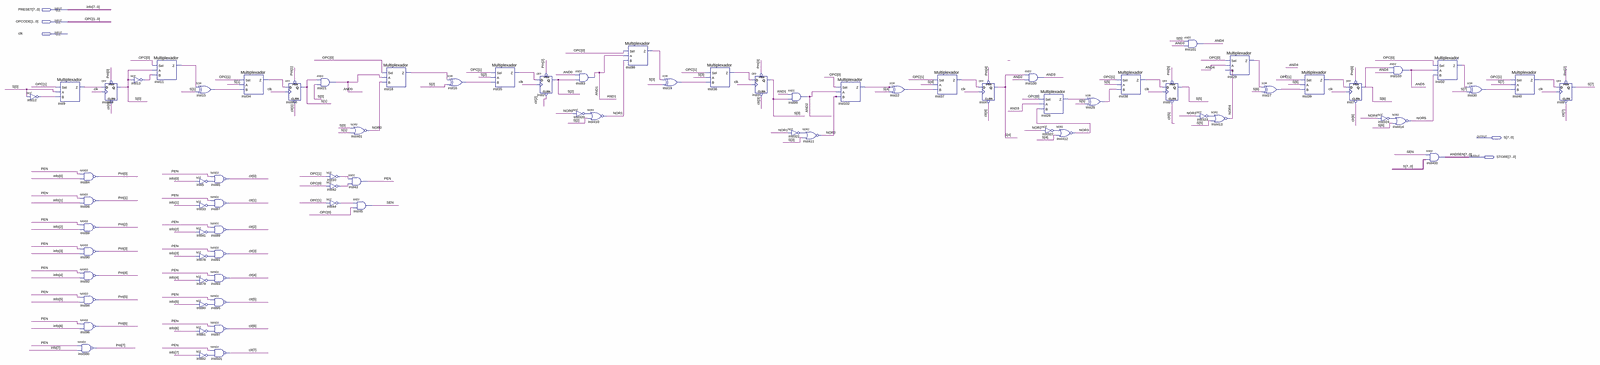
[diagram p0: schematic sheet, whole]
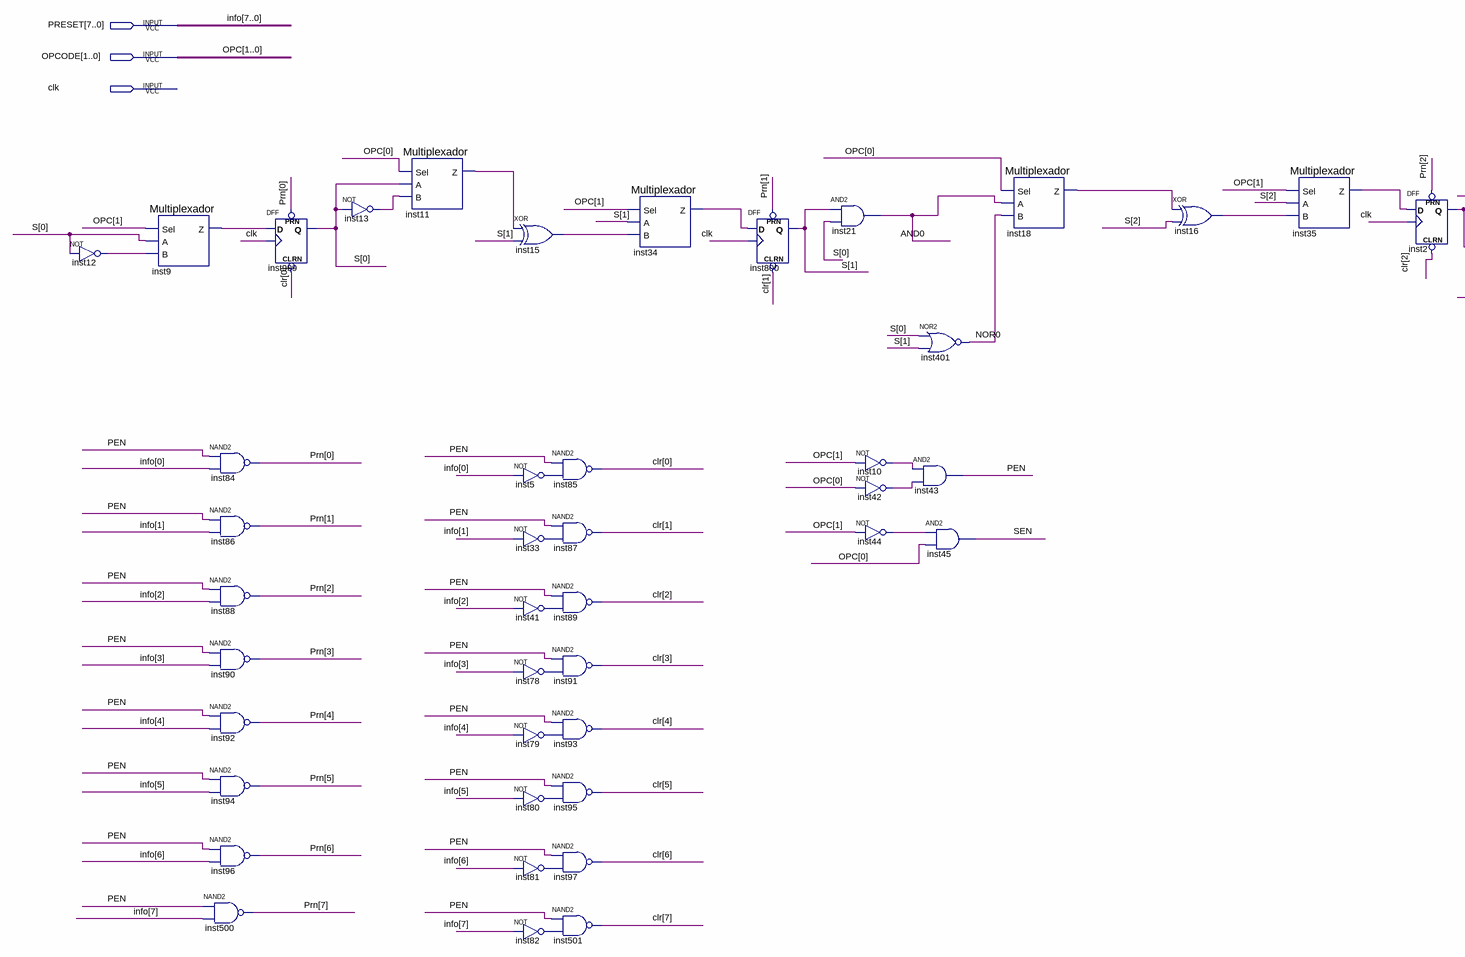
[diagram p1: schematic sheet, left part]
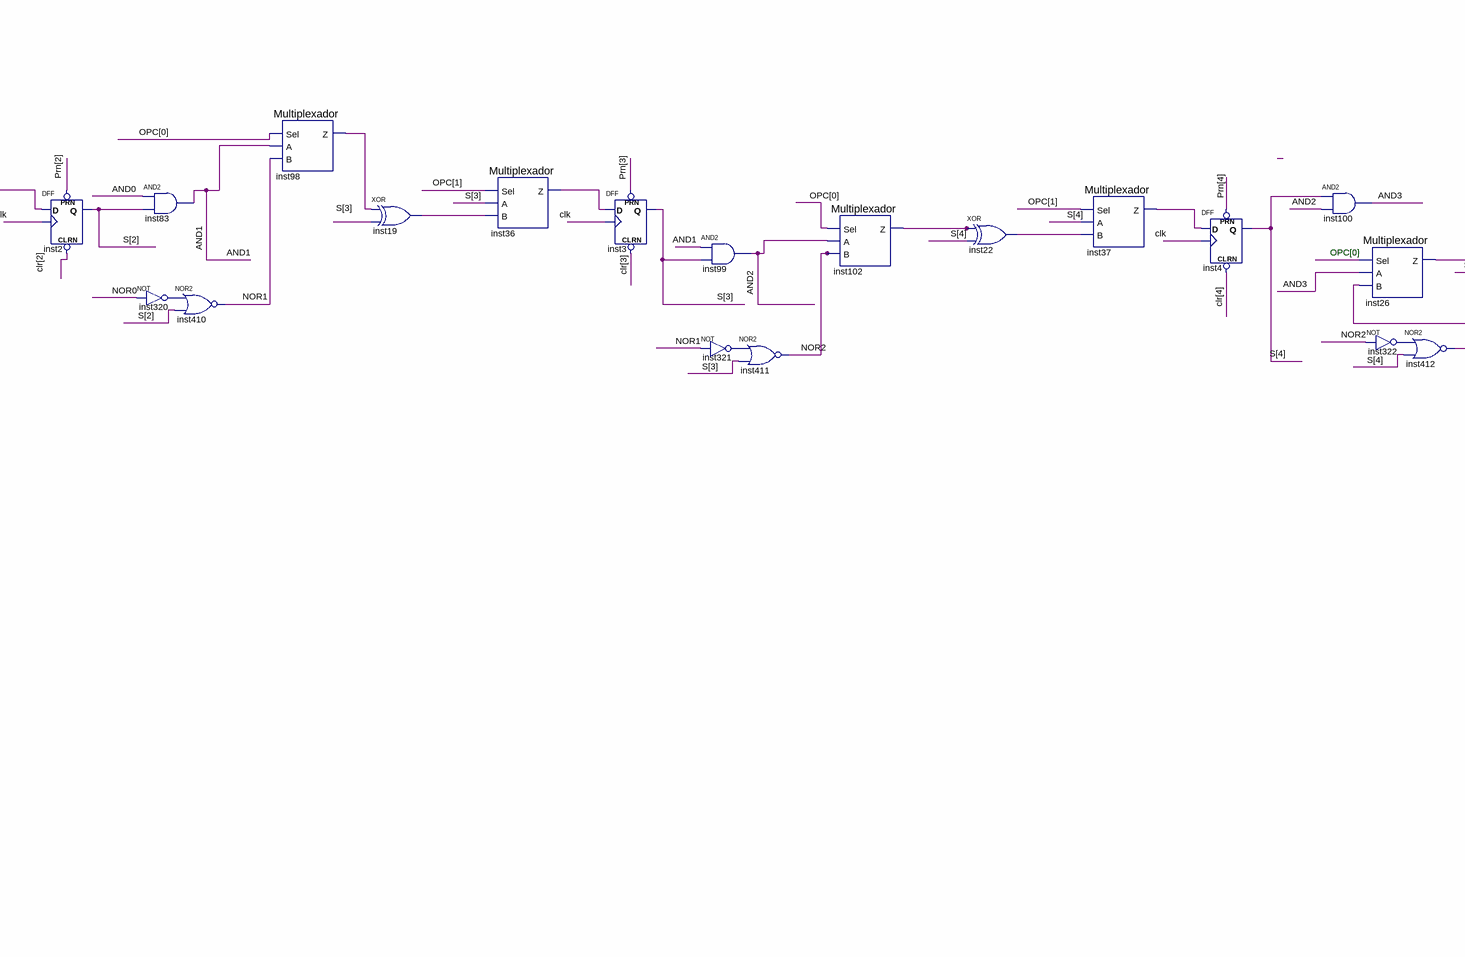
[diagram p2: schematic sheet, centre part]
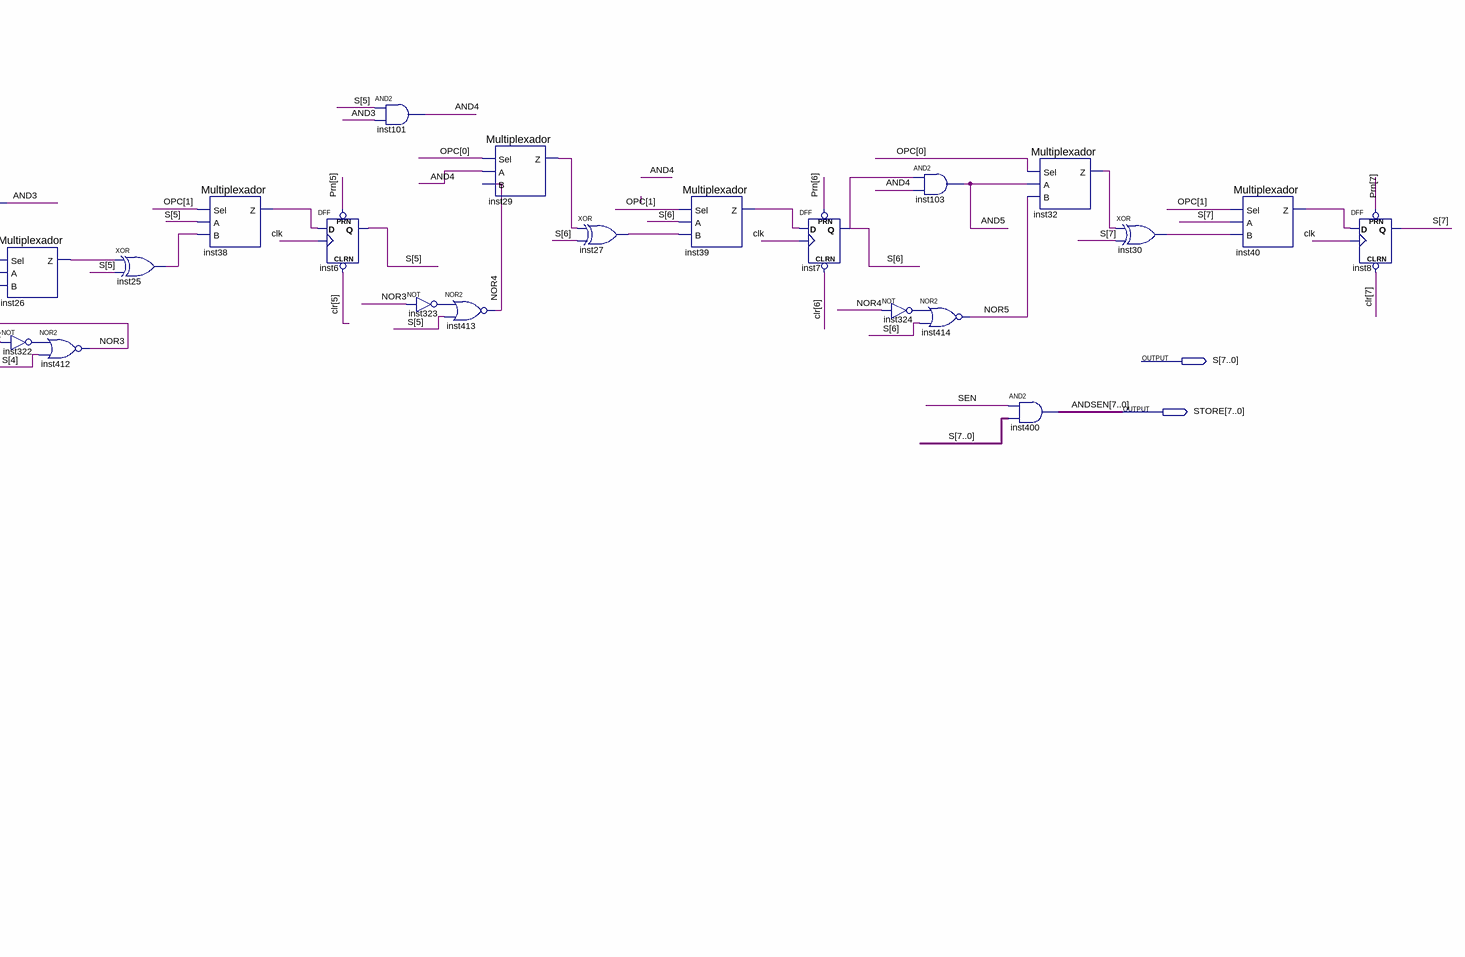
[diagram p3: schematic sheet, right part]
// Quartus schematic PC.bdf as structural Verilog: 79 symbols, 5 pins
module PC (
  input  [7:0] PRESET,
  input  [1:0] OPCODE,
  input  clk,
  output [7:0] S,
  output [7:0] STORE
);

  wire AND0, AND1, AND2, AND3, AND4, AND5, inst5_out, inst9_z, inst10_out, inst11_z, inst12_out, inst13_out,
       inst15_out, inst16_out, inst18_z, inst19_out, inst22_out, inst25_out, inst26_z, inst27_out, inst29_z,
       inst30_out, inst32_z, inst33_out, inst34_z, inst35_z, inst36_z, inst37_z, inst38_z, inst39_z,
       inst40_z, inst41_out, inst42_out, inst44_out, inst78_out, inst79_out, inst80_out, inst81_out,
       inst82_out, inst98_z, inst102_z, inst320_out, inst321_out, inst322_out, inst323_out, inst324_out,
       NOR0, NOR1, NOR2, NOR3, NOR4, NOR5, PEN, SEN;
  wire [7:0] clr, Prn;

  not inst12 (inst12_out, S[0]);
  Multiplexador inst9 (.Sel(OPCODE[1]), .A(S[0]), .B(inst12_out), .Z(inst9_z));
  nand inst84 (Prn[0], PEN, PRESET[0]);
  nand inst86 (Prn[1], PEN, PRESET[1]);
  nand inst88 (Prn[2], PEN, PRESET[2]);
  nand inst90 (Prn[3], PEN, PRESET[3]);
  nand inst92 (Prn[4], PEN, PRESET[4]);
  nand inst94 (Prn[5], PEN, PRESET[5]);
  nand inst96 (Prn[6], PEN, PRESET[6]);
  nand inst500 (Prn[7], PEN, PRESET[7]);
  DFF inst999 (.CLRN(clr[0]), .CLK(clk), .D(inst9_z), .PRN(Prn[0]), .Q(S[0]));
  not inst13 (inst13_out, S[0]);
  Multiplexador inst11 (.Sel(OPCODE[0]), .A(S[0]), .B(inst13_out), .Z(inst11_z));
  xor inst15 (inst15_out, inst11_z, S[1]);
  not inst5 (inst5_out, PRESET[0]);
  not inst33 (inst33_out, PRESET[1]);
  not inst41 (inst41_out, PRESET[2]);
  not inst78 (inst78_out, PRESET[3]);
  not inst79 (inst79_out, PRESET[4]);
  not inst80 (inst80_out, PRESET[5]);
  not inst81 (inst81_out, PRESET[6]);
  not inst82 (inst82_out, PRESET[7]);
  nand inst85 (clr[0], PEN, inst5_out);
  nand inst87 (clr[1], PEN, inst33_out);
  nand inst89 (clr[2], PEN, inst41_out);
  nand inst91 (clr[3], PEN, inst78_out);
  nand inst93 (clr[4], PEN, inst79_out);
  nand inst95 (clr[5], PEN, inst80_out);
  nand inst97 (clr[6], PEN, inst81_out);
  nand inst501 (clr[7], PEN, inst82_out);
  Multiplexador inst34 (.Sel(OPCODE[1]), .A(S[1]), .B(inst15_out), .Z(inst34_z));
  DFF inst800 (.CLRN(clr[1]), .CLK(clk), .D(inst34_z), .PRN(Prn[1]), .Q(S[1]));
  and inst21 (AND0, S[1], S[0]);
  not inst10 (inst10_out, OPCODE[1]);
  not inst42 (inst42_out, OPCODE[0]);
  not inst44 (inst44_out, OPCODE[1]);
  nor inst401 (NOR0, S[0], S[1]);
  and inst43 (PEN, inst10_out, inst42_out);
  and inst45 (SEN, inst44_out, OPCODE[0]);
  Multiplexador inst18 (.Sel(OPCODE[0]), .A(AND0), .B(NOR0), .Z(inst18_z));
  xor inst16 (inst16_out, inst18_z, S[2]);
  Multiplexador inst35 (.Sel(OPCODE[1]), .A(S[2]), .B(inst16_out), .Z(inst35_z));
  DFF inst2 (.CLRN(clr[2]), .CLK(clk), .D(inst35_z), .PRN(Prn[2]), .Q(S[2]));
  and inst83 (AND1, AND0, S[2]);
  not inst320 (inst320_out, NOR0);
  nor inst410 (NOR1, inst320_out, S[2]);
  Multiplexador inst98 (.Sel(OPCODE[0]), .A(AND1), .B(NOR1), .Z(inst98_z));
  xor inst19 (inst19_out, inst98_z, S[3]);
  Multiplexador inst36 (.Sel(OPCODE[1]), .A(S[3]), .B(inst19_out), .Z(inst36_z));
  DFF inst3 (.CLRN(clr[3]), .CLK(clk), .D(inst36_z), .PRN(Prn[3]), .Q(S[3]));
  and inst99 (AND2, AND1, S[3]);
  not inst321 (inst321_out, NOR1);
  nor inst411 (NOR2, inst321_out, S[3]);
  Multiplexador inst102 (.Sel(OPCODE[0]), .A(AND2), .B(NOR2), .Z(inst102_z));
  xor inst22 (inst22_out, inst102_z, S[4]);
  Multiplexador inst37 (.Sel(OPCODE[1]), .A(S[4]), .B(inst22_out), .Z(inst37_z));
  DFF inst4 (.CLRN(clr[4]), .CLK(clk), .D(inst37_z), .PRN(Prn[4]), .Q(S[4]));
  and inst100 (AND3, S[4], AND2);
  Multiplexador inst26 (.Sel(OPCODE[0]), .A(AND3), .B(NOR3), .Z(inst26_z));
  not inst322 (inst322_out, NOR2);
  nor inst412 (NOR3, inst322_out, S[4]);
  xor inst25 (inst25_out, inst26_z, S[5]);
  Multiplexador inst38 (.Sel(OPCODE[1]), .A(S[5]), .B(inst25_out), .Z(inst38_z));
  DFF inst6 (.CLRN(clr[5]), .CLK(clk), .D(inst38_z), .PRN(Prn[5]), .Q(S[5]));
  and inst101 (AND4, S[5], AND3);
  not inst323 (inst323_out, NOR3);
  Multiplexador inst29 (.Sel(OPCODE[0]), .A(AND4), .B(NOR4), .Z(inst29_z));
  nor inst413 (NOR4, inst323_out, S[5]);
  xor inst27 (inst27_out, inst29_z, S[6]);
  Multiplexador inst39 (.Sel(OPCODE[1]), .A(S[6]), .B(inst27_out), .Z(inst39_z));
  DFF inst7 (.CLRN(clr[6]), .CLK(clk), .D(inst39_z), .PRN(Prn[6]), .Q(S[6]));
  not inst324 (inst324_out, NOR4);
  and inst103 (AND5, S[6], AND4);
  nor inst414 (NOR5, inst324_out, S[6]);
  Multiplexador inst32 (.Sel(OPCODE[0]), .A(AND5), .B(NOR5), .Z(inst32_z));
  assign STORE = {8{SEN}} & S;  // AND2 inst400, 8 bits wide
  xor inst30 (inst30_out, inst32_z, S[7]);
  Multiplexador inst40 (.Sel(OPCODE[1]), .A(S[7]), .B(inst30_out), .Z(inst40_z));
  DFF inst8 (.CLRN(clr[7]), .CLK(clk), .D(inst40_z), .PRN(Prn[7]), .Q(S[7]));

  // Other names for the same wires on the sheet: ANDSEN[7:0] = STORE; info[7:0] = PRESET; OPC[1:0] = OPCODE

  // Notes on the sheet:
  //   OPC[0]
endmodule
